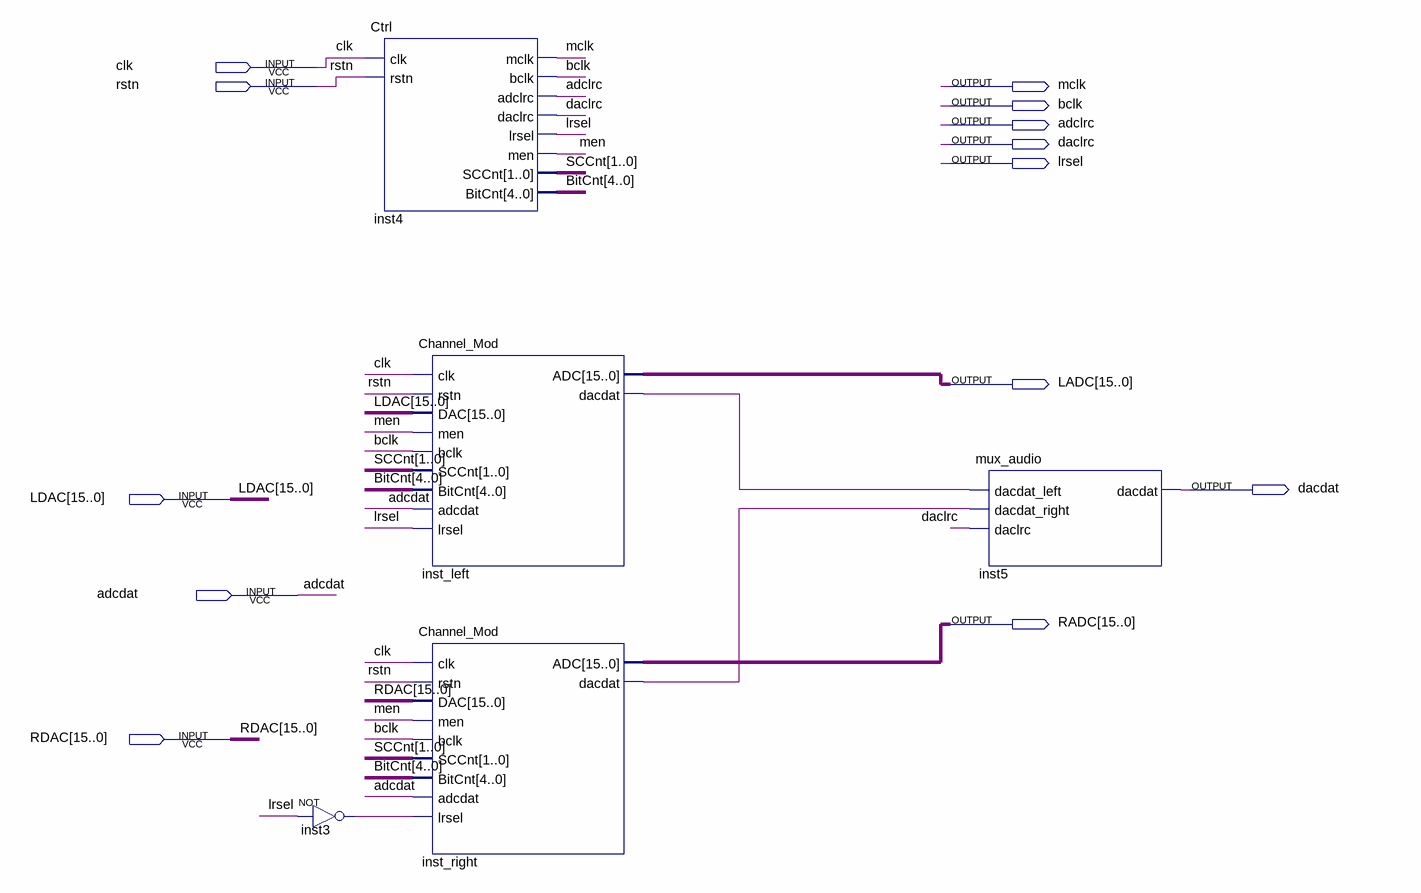
[diagram p0: schematic sheet]
// Quartus schematic SndDriver.bdf as structural Verilog: 5 symbols, 13 pins
module SndDriver (
  input  clk,
  input  rstn,
  input  [15:0] LDAC,
  input  adcdat,
  input  [15:0] RDAC,
  output mclk,
  output bclk,
  output adclrc,
  output daclrc,
  output lrsel,
  output [15:0] LADC,
  output dacdat,
  output [15:0] RADC
);

  wire inst3_out, inst_left_dacdat, inst_right_dacdat, men;
  wire [1:0] SCCnt;
  wire [4:0] BitCnt;

  not inst3 (inst3_out, lrsel);
  Ctrl inst4 (
    .clk(clk), .rstn(rstn), .mclk(mclk), .bclk(bclk), .adclrc(adclrc), .daclrc(daclrc), .lrsel(lrsel),
    .men(men), .SCCnt(SCCnt), .BitCnt(BitCnt));
  Channel_Mod inst_left (
    .clk(clk), .rstn(rstn), .DAC(LDAC), .men(men), .bclk(bclk), .SCCnt(SCCnt), .BitCnt(BitCnt),
    .adcdat(adcdat), .lrsel(lrsel), .ADC(LADC), .dacdat(inst_left_dacdat));
  Channel_Mod inst_right (
    .clk(clk), .rstn(rstn), .DAC(RDAC), .men(men), .bclk(bclk), .SCCnt(SCCnt), .BitCnt(BitCnt),
    .adcdat(adcdat), .lrsel(inst3_out), .ADC(RADC), .dacdat(inst_right_dacdat));
  mux_audio inst5 (.dacdat_left(inst_left_dacdat), .dacdat_right(inst_right_dacdat), .daclrc(daclrc), .dacdat(dacdat));
endmodule
